# Altium schematic sheet usb-cereal-sys.SchDoc: USB-Cereal Diagram
size Tabloid; Author: dnv; DocumentNumber: N/A; Revision: 1; SheetNumber: 1; SheetTotal: 2
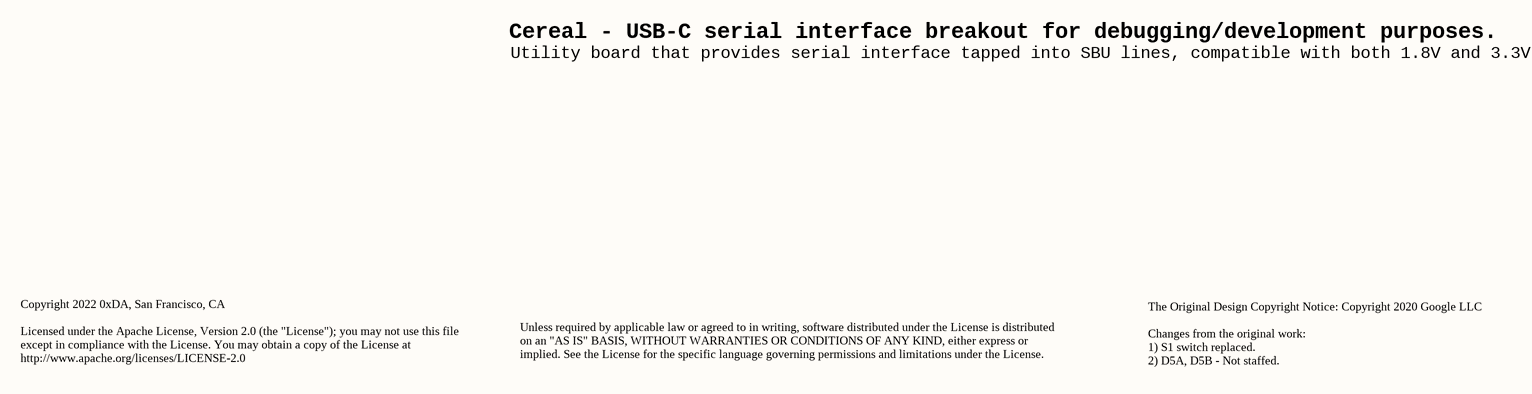
[diagram p0: usb-cereal-sys.SchDoc]

## Notes on the sheet
- Cereal - USB-C serial interface breakout for debugging/development purposes.
- Utility board that provides serial interface tapped into SBU lines, compatible with both 1.8V and 3.3V signalling.
- Copyright 2022 0xDA, San Francisco, CA
  Licensed under the Apache License, Version 2.0 (the "License"); you may not use this file except in compliance with the License. You may obtain a copy of the License at  http://www.apache.org/licenses/LICENSE-2.0
- Unless required by applicable law or agreed to in writing, software distributed under the License is distributed on an "AS IS" BASIS, WITHOUT WARRANTIES OR CONDITIONS OF ANY KIND, either express or implied. See the License for the specific language governing permissions and limitations under the License.
- The Original Design Copyright Notice: Copyright 2020 Google LLC
  Changes from the original work:
  1) S1 switch replaced.
  2) D5A, D5B - Not staffed.
- GPN:
- Title:
- Revision:
- Size:
- Tabloid
- Author:
- Reviewers:
- Date:
- Time:
- Sheet
- of